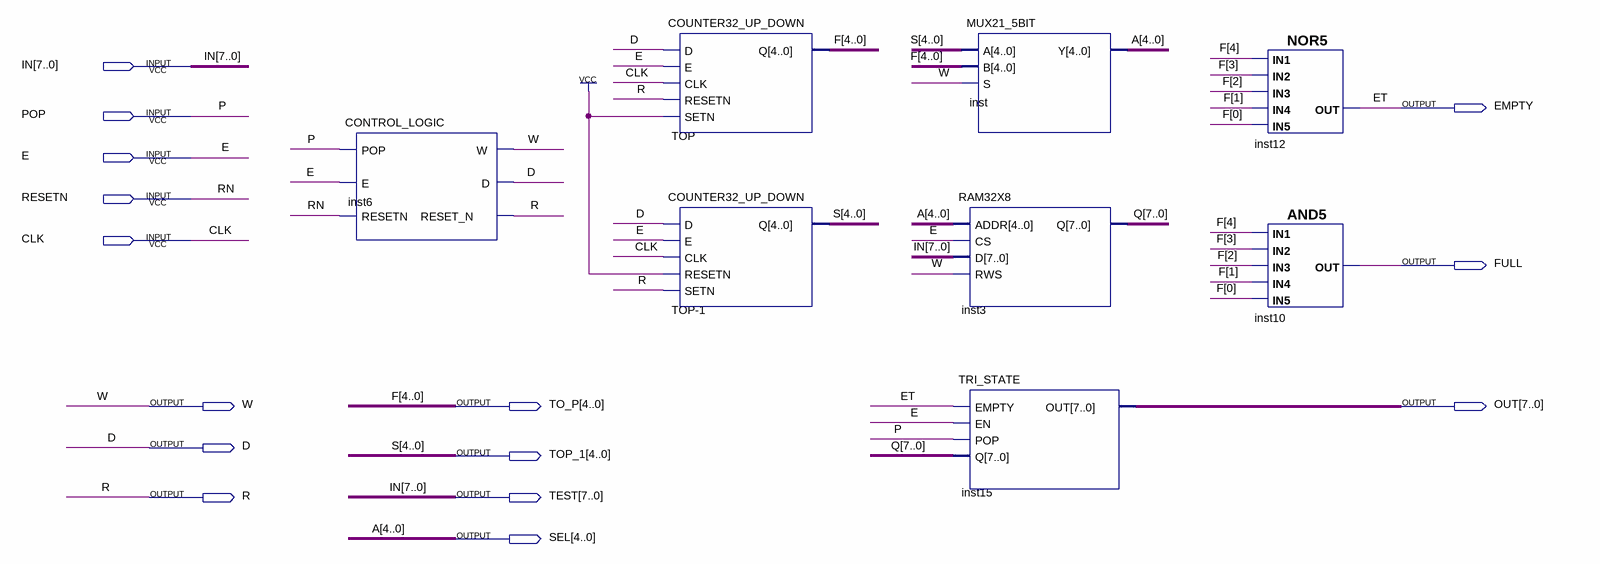
[diagram p0: schematic sheet]
// Quartus schematic Block1.bdf as structural Verilog: 8 symbols, 15 pins
module Block1 (
  input  [7:0] IN,
  input  POP,
  input  E,
  input  RESETN,
  input  CLK,
  output EMPTY,
  output FULL,
  output W,
  output [4:0] TO_P,
  output [7:0] OUT,
  output D,
  output [4:0] TOP_1,
  output R,
  output [7:0] TEST,
  output [4:0] SEL
);

  wire [7:0] Q;

  CONTROL_LOGIC inst6 (.POP(POP), .E(E), .RESETN(RESETN), .W(W), .D(D), .RESET_N(R));
  COUNTER32_UP_DOWN TOP (.D(D), .E(E), .CLK(CLK), .RESETN(R), .SETN(1'b1), .Q(TO_P));
  COUNTER32_UP_DOWN \TOP-1  (.D(D), .E(E), .CLK(CLK), .RESETN(1'b1), .SETN(R), .Q(TOP_1));
  MUX21_5BIT inst (.A(TOP_1), .B(TO_P), .S(W), .Y(SEL));
  RAM32X8 inst3 (.ADDR(SEL), .CS(E), .D(IN), .RWS(W), .Q(Q));
  TRI_STATE inst15 (.EMPTY(EMPTY), .EN(E), .POP(POP), .Q(Q), .OUT(OUT));
  nor inst12 (EMPTY, TO_P[4], TO_P[3], TO_P[2], TO_P[1], TO_P[0]);
  and inst10 (FULL, TO_P[4], TO_P[3], TO_P[2], TO_P[1], TO_P[0]);

  assign TEST = IN;

  // Other names for the same wires on the sheet: A[4:0] = SEL; ET = EMPTY; F[4:0] = TO_P; P = POP; RN = RESETN;
  //   S[4:0] = TOP_1
endmodule
